# Altium schematic sheet Sheet1.SchDoc: AccuRadius Zippy
size Letter; DrawnBy: FKA; DocumentNumber: 16614; Revision: 1; SheetNumber: 1; SheetTotal: 1
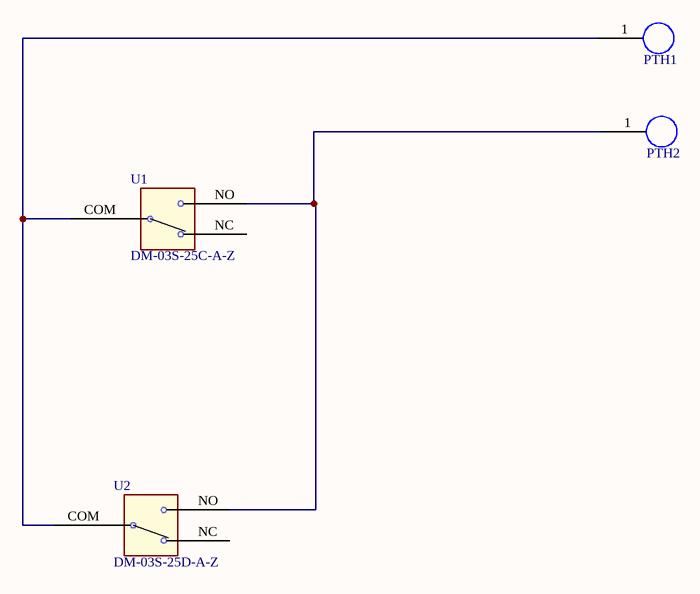
[diagram p0: Sheet1.SchDoc]

## Parts
PTH1  Plated through hole  [PTH_70mil]  (value not drawn)
PTH2  Plated through hole  [PTH_70mil]  (value not drawn)
U1  DM-03S-25C-A-Z  [DM-03S-25C-A-Z]
U2  DM-03S-25D-A-Z  [DM-03S-25D-A-Z]

## Nets
NetPTH1_1: PTH1.1(PTH) U1.COM U2.COM
NetPTH2_1: PTH2.1(PTH) U1.NO U2.NO

Not connected (* = marked no-connect by the designer): U1 NC; U2 NC

## Library data of the parts
PTH1 PTH2 = PTH
U1 = Component_1: Roller switch left; Manufacturer 1: Zippy; Manufacturer Part Number 1: DM-03S-25C-A-Z
U2 = Component_1: Roller switch right; Manufacturer 1: Zippy; Manufacturer Part Number 1: DM-03S-25D-A-Z